# Altium project DMI.PrjPcb
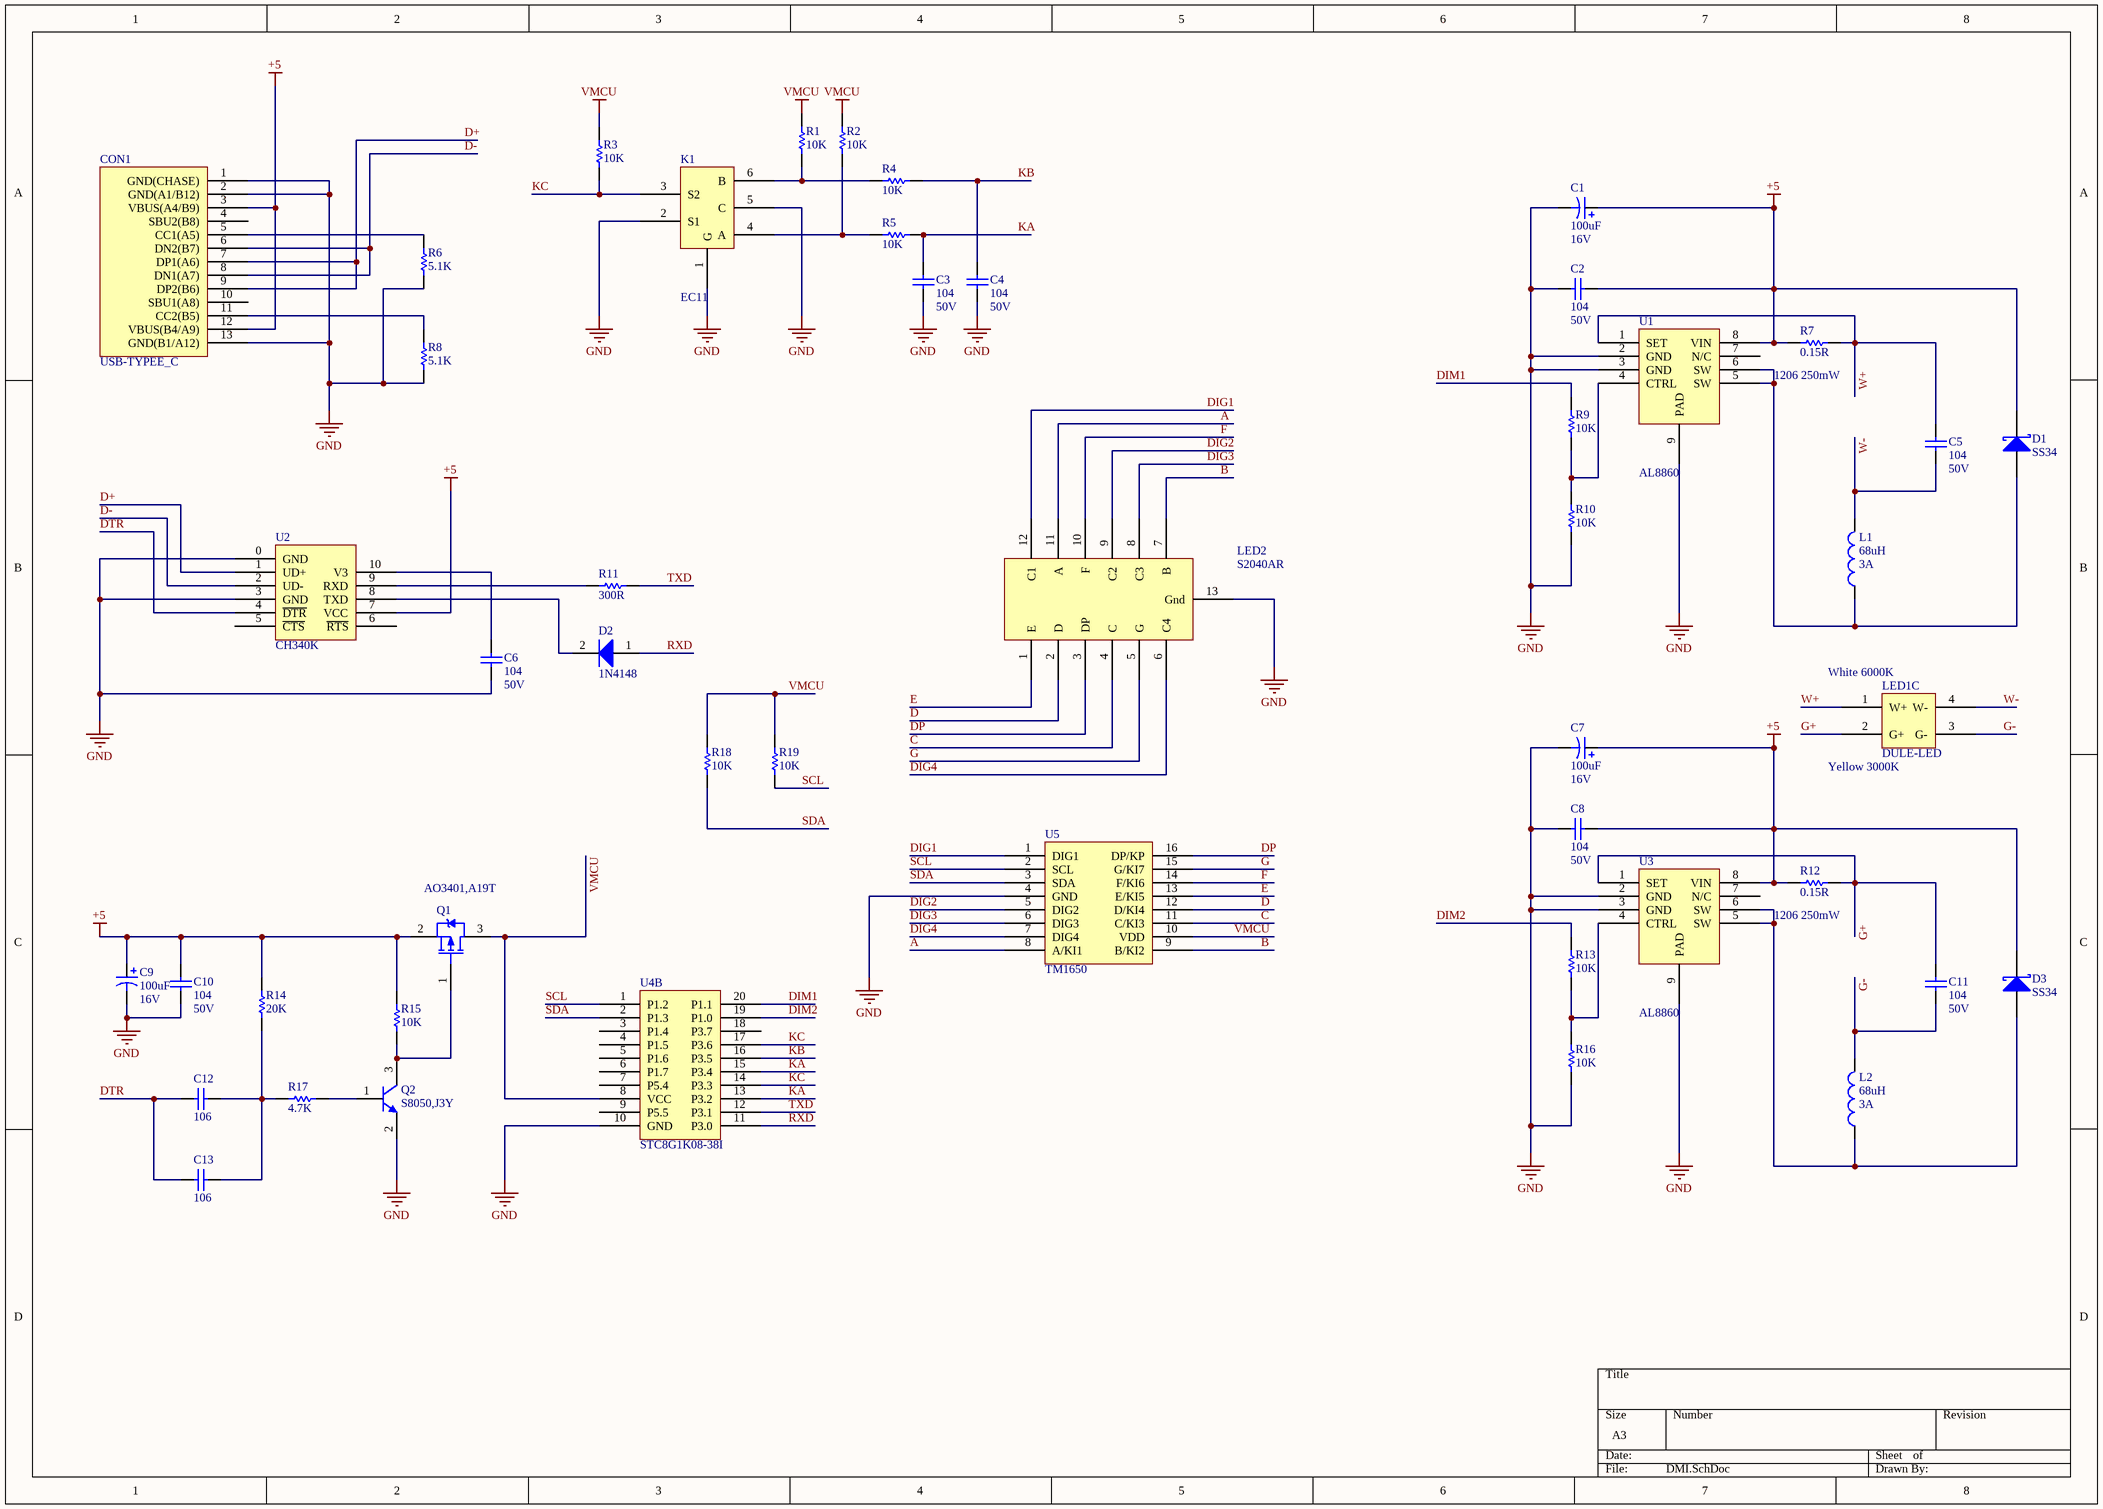
[diagram p0: DMI.SchDoc]
1 sheet, 48 parts. Net scope: global (net labels, ports and power ports of the same name join across sheets).
Board file: DMI.PcbDoc

## Sheet DMI.SchDoc
size A3; SheetNumber: 1; SheetTotal: 1

### Parts
C1  16V  value 100uF  [TC6032-2412]
C2  50V  value 104  [CAPC1608L]
C3  50V  value 104  [CAPC1608L]
C4  50V  value 104  [CAPC1608L]
C5  50V  value 104  [CAPC1608L]
C6  50V  value 104  [CAPC1608L]
C7  16V  value 100uF  [TC6032-2412]
C8  50V  value 104  [CAPC1608L]
C9  16V  value 100uF  [TC6032-2412]
C10  50V  value 104  [CAPC1608L]
C11  50V  value 104  [CAPC1608L]
C12  value 106  [CAPC1608L]
C13  value 106  [CAPC1608L]
CON1  USB-TYPEE_C  [USB-TYPE_C]
D1  SS34  [DO-214AC]
D2  1N4148  [CD3216-1206]
D3  SS34  [DO-214AC]
K1  EC11  [EC11]
L1  3A  value 68uH  [CYH125]
L2  3A  value 68uH  [CYH125]
LED1  DULE-LED  [DULE-LED-3W]  (part C of 3)
LED2  S2040AR  [S2040AR]
Q1  AO3401,A19T  [SOT-23B_L]
Q2  S8050,J3Y  [SOT-23B_L]
R1  value 10K  [RESC1608L]  (hidden comment: Res1)
R2  value 10K  [RESC1608L]  (hidden comment: Res1)
R3  value 10K  [RESC1608L]  (hidden comment: Res1)
R4  value 10K  [RESC1608L]  (hidden comment: Res1)
R5  value 10K  [RESC1608L]  (hidden comment: Res1)
R6  value 5.1K  [RESC1608L]  (hidden comment: Res1)
R7  1206 250mW  value 0.15R  [RESC3216L]
R8  value 5.1K  [RESC1608L]  (hidden comment: Res1)
R9  value 10K  [RESC1608L]  (hidden comment: Res1)
R10  value 10K  [RESC1608L]  (hidden comment: Res1)
R11  value 300R  [RESC1608L]  (hidden comment: Res1)
R12  1206 250mW  value 0.15R  [RESC3216L]
R13  value 10K  [RESC1608L]  (hidden comment: Res1)
R14  value 20K  [RESC1608L]  (hidden comment: Res1)
R15  value 10K  [RESC1608L]  (hidden comment: Res1)
R16  value 10K  [RESC1608L]  (hidden comment: Res1)
R17  value 4.7K  [RESC1608L]  (hidden comment: Res1)
R18  value 10K  [RESC1608L]  (hidden comment: Res1)
R19  value 10K  [RESC1608L]  (hidden comment: Res1)
U1  AL8860  [TSOP65P490_HS-8N]
U2  CH340K  [ESOP100-10]
U3  AL8860  [TSOP65P490_HS-8N]
U4  STC8G1K08-38I  [TSOP65P640-20BL]  (part B of 2)
U5  TM1650  [SOP127P762-16L]

### Nets
+5: C1.1 C2.2 C7.1 C8.2 C9.1 C10.2 CON1.3(VBUS(A4/B9)) CON1.12(VBUS(B4/A9)) D1.2(K) D3.2(K) Q1.2(S) R7.2 R12.2 R14.1 R15.2 U1.8(VIN) U2.7(VCC) U3.8(VIN)
GND: C1.2 C2.1 C3.1 C4.1 C6.1 C7.2 C8.1 C9.2 C10.1 CON1.1(GND(CHASE)) CON1.2(GND(A1/B12)) CON1.13(GND(B1/A12)) K1.1(G) K1.2(S1) K1.5(C) LED2.13(Gnd) Q2.2(E) R6.2 R8.2 R10.2 R16.2 U1.2(GND) U1.3(GND) U1.9(PAD) U2.0(GND) U2.3(GND) U3.2(GND) U3.3(GND) U3.9(PAD) U4.10(GND) U5.4(GND)
VMCU: Q1.3(D) R1.1 R2.1 R3.1 R18.2 R19.2 U4.8(VCC) U5.10(VDD)
A: LED2.11(A) U5.8(A/KI1)
B: LED2.7(B) U5.9(B/KI2)
C: LED2.4(C) U5.11(C/KI3)
D: LED2.2(D) U5.12(D/KI4)
D+: CON1.7(DP1(A6)) CON1.9(DP2(B6)) U2.1(UD+)
D-: CON1.6(DN2(B7)) CON1.8(DN1(A7)) U2.2(UD-)
DIG1: LED2.12(C1) U5.1(DIG1)
DIG2: LED2.9(C2) U5.5(DIG2)
DIG3: LED2.8(C3) U5.6(DIG3)
DIG4: LED2.6(C4) U5.7(DIG4)
DIM1: R9.1 U4.20(P1.1)
DIM2: R13.1 U4.19(P1.0)
DP: LED2.3(DP) U5.16(DP/KP)
DTR: C12.2 C13.2 U2.4(~{DTR})
E: LED2.1(E) U5.13(E/KI5)
F: LED2.10(F) U5.14(F/KI6)
G: LED2.5(G) U5.15(G/KI7)
G+: C11.2 LED1.2(G+) R12.1 U3.1(SET)
G-: C11.1 L2.2 LED1.3(G-)
KA: C3.2 R5.2 U4.13(P3.2) U4.15(P3.4)
KB: C4.2 R4.2 U4.16(P3.5)
KC: K1.3(S2) R3.2 U4.14(P3.3) U4.17(P3.6)
RXD: D2.1(A) U4.11(P3.0)
SCL: R19.1 U4.1(P1.2) U5.2(SCL)
SDA: R18.1 U4.2(P1.3) U5.3(SDA)
TXD: R11.2 U4.12(P3.1)
W+: C5.2 LED1.1(W+) R7.1 U1.1(SET)
W-: C5.1 L1.2 LED1.4(W-)
NetC6_2: C6.2 U2.10(V3)
NetC12_1: C12.1 C13.1 R14.2 R17.2
NetCON1_5: CON1.5(CC1(A5)) R6.1
NetCON1_11: CON1.11(CC2(B5)) R8.1
NetD1_1: D1.1(A) L1.1 U1.5(SW) U1.6(SW)
NetD2_2: D2.2(K) U2.8(TXD)
NetD3_1: D3.1(A) L2.1 U3.5(SW) U3.6(SW)
NetK1_4: K1.4(A) R2.2 R5.1
NetK1_6: K1.6(B) R1.2 R4.1
NetQ1_1: Q1.1(G) Q2.3(C) R15.1
NetQ2_1: Q2.1(B) R17.1
NetR9_2: R9.2 R10.1 U1.4(CTRL)
NetR11_1: R11.1 U2.9(RXD)
NetR13_2: R13.2 R16.1 U3.4(CTRL)

Not connected (* = marked no-connect by the designer): CON1 4(SBU2(B8)) 10(SBU1(A8)); U1 7(N/C); U2 5(~{CTS}) 6(~{RTS}); U3 7(N/C); U4 3(P1.4) 4(P1.5) 5(P1.6) 6(P1.7) 7(P5.4) 9(P5.5) 18(P3.7)

### Notes on the sheet
- (near LED1) White 6000K
- (near LED1) Yellow 3000K

### Library data of the parts
C1 C7 C9 = Cap Pol1: Polarized Capacitor (Radial); Published: 8-Jun-2000; LatestRevisionDate: 17-Jul-2002; LatestRevisionNote: Re-released for DXP Platform.; PackageReference: RB7.6-15; Publisher: Altium Limited; PackageDescription: Polarized Capacitor (Radial); 2 Leads
C2-C6 C8 C10-C13 = Cap: Capacitor; Published: 8-Jun-2000; LatestRevisionDate: 17-Jul-2002; LatestRevisionNote: Re-released for DXP Platform.; PackageReference: RAD-0.3; Publisher: Altium Limited; PackageDescription: Radial Cap, Thru-Hole; 2 Leads; 0.3 in Pin Spacing
D1 D3 = D Schottky: Schottky Diode; Published: 8-Jun-2000; LatestRevisionDate: 17-Jul-2002; LatestRevisionNote: Re-released for DXP Platform.; PackageReference: SMB; Publisher: Altium Limited; PackageDescription: DO-214-AA/SMB; 2 C-Bend Leads; Body 5.3 x 3.6 mm, inc. leads (LxW); Code_JEDEC: DO-214-AA
D2 = Diode: Default Diode; Published: 8-Jun-2000; LatestRevisionDate: 17-Jul-2002; LatestRevisionNote: Re-released for DXP Platform.; PackageVersion: Sep-1996; PackageReference: SMC; Publisher: Altium Limited; PackageDescription: DO-214-AB/SMC; 2 C-Bend Leads; Body 7.9 x 5.9 mm, inc. leads (LxW); Code_JEDEC: DO-214-AB
L1 L2 = Inductor: Code_IEC: 1005; Published: 8-Jun-2000; LatestRevisionDate: 29-May-2009; LatestRevisionNote: IPC-7351 Footprint Added.; PackageReference: 0402-A; Publisher: Altium Limited; PackageDescription: Chip Inductor; Code_JEITA: 0402
Q1 = PMOS-2: P-Channel Power MOSFET; Note: Pin 4 not drawn and electrically connected to Pin 2.; Published: 8-Jun-2000; LatestRevisionDate: 17-Jul-2002; LatestRevisionNote: Re-released for DXP Platform.; DatasheetVersion: PD-9.390D; PackageVersion: Feb-1997; PackageReference: TO-220AB; Publisher: Altium Limited; PackageDescription: TO, Thru-Hole, Vertical, Heatsink Mounted; 3 In-Line Leads; Pitch 2.54 mm; ComponentLink1Description: Manufacturer Link; ComponentLink1URL: http://www.irf.com/
Q2 = NPN: NPN Bipolar Transistor; Published: 8-Jun-2000; LatestRevisionDate: 17-Jul-2002; LatestRevisionNote: Re-released for DXP Platform.; PackageReference: TO-226-AA; Publisher: Altium Limited; PackageDescription: TO, Flat Index; 3 In-Line, Axial Leads; Body Dia. 4.8mm; Leads 0.55 x 0.51 mm (max); Code_JEDEC: TO-226-AA
R1-R19 = Res1: Resistor; Published: 8-Jun-2000; LatestRevisionDate: 17-Jul-2002; LatestRevisionNote: Re-released for DXP Platform.; PackageReference: AXIAL-0.3; Publisher: Altium Limited; PackageDescription: Axial Device, Thru-Hole; 2 Leads; 0.3 in Pin Spacing